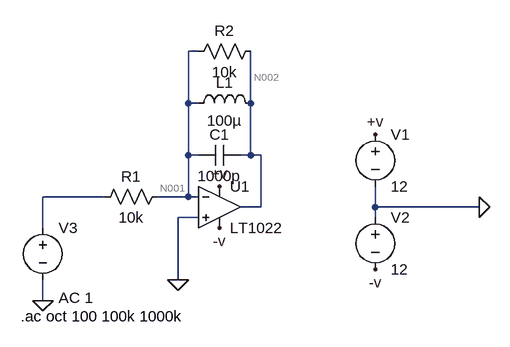
[diagram p0: schematic Draft26.asc]
Draft26.asc, the LTspice schematic file:
Version 4
SHEET 1 880 680
WIRE 176 -48 160 -48
WIRE 160 32 160 -48
WIRE 176 32 160 32
WIRE 256 32 256 -48
WIRE 160 112 160 32
WIRE 176 112 160 112
WIRE 256 112 256 32
WIRE 256 112 240 112
WIRE 272 112 256 112
WIRE 32 176 -64 176
WIRE 160 176 160 112
WIRE 160 176 112 176
WIRE 176 176 160 176
WIRE 272 192 272 112
WIRE 272 192 240 192
WIRE 448 192 448 160
WIRE 608 192 448 192
WIRE 176 208 144 208
WIRE 448 208 448 192
WIRE -64 224 -64 176
WIRE 144 304 144 208
WIRE -64 336 -64 304
FLAG 208 160 +v
FLAG 448 80 +v
FLAG 208 224 -v
FLAG 448 288 -v
FLAG -64 336 0
FLAG 144 304 0
FLAG 608 192 0
SYMBOL voltage 448 64 R0
SYMATTR InstName V1
SYMATTR Value 12
SYMBOL voltage 448 192 R0
SYMATTR InstName V2
SYMATTR Value 12
SYMBOL voltage -64 208 R0
WINDOW 123 24 124 Left 2
WINDOW 39 0 0 Left 0
SYMATTR InstName V3
SYMATTR Value ""
SYMATTR Value2 AC 1
SYMBOL Opamps\\LT1022 208 128 R0
SYMATTR InstName U1
SYMBOL res 128 160 R90
WINDOW 0 0 56 VBottom 2
WINDOW 3 32 56 VTop 2
SYMATTR InstName R1
SYMATTR Value 10k
SYMBOL res 272 -64 R90
WINDOW 0 0 56 VBottom 2
WINDOW 3 32 56 VTop 2
SYMATTR InstName R2
SYMATTR Value 10k
SYMBOL ind 160 48 R270
WINDOW 0 32 56 VTop 2
WINDOW 3 5 56 VBottom 2
SYMATTR InstName L1
SYMATTR Value 100µ
SYMBOL cap 240 96 R90
WINDOW 0 0 32 VBottom 2
WINDOW 3 32 32 VTop 2
SYMATTR InstName C1
SYMATTR Value 1000p
TEXT -98 360 Left 2 !.ac oct 100 100k 1000k

The netlist it stands for:
* Draft26.asc
V1 +v 0 12
V2 0 -v 12
V3 N003 0 AC 1
XU1 0 N001 +v -v N002 LT1022  ; pins In+ In- V+ V- OUT
R1 N001 N003 10k
R2 N002 N001 10k
L1 N001 N002 100µ
C1 N002 N001 1000p
.ac oct 100 100k 1000k
.backanno
.end

* Results of the author's LTspice run, read from the files saved beside the schematic
* Operating Point, zero values left out:
*   V(+v) = 12 V
*   V(-v) = -12 V
*   I(V2) = -5.2 mA
*   I(V1) = -5.2 mA
*   Ix(u1:3) = 5.2 mA
*   Ix(u1:4) = -5.2 mA
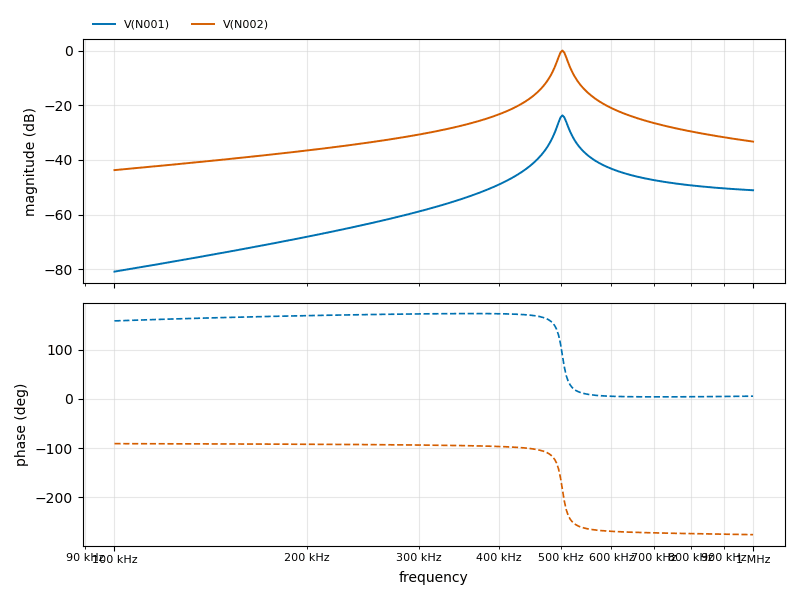
[diagram p1: AC Analysis of Draft26.asc, plotted from the saved traces]
* AC Analysis, 1 run:
*   V(N001): -80.85 dB at 100 kHz, -51.09 dB at 1 MHz, peak -23.69 dB at 502.8 kHz, 3 dB below the peak at 495.2 kHz and 511 kHz
*   V(N002): -43.73 dB at 100 kHz, -33.30 dB at 1 MHz, peak 0.03 dB at 502.8 kHz, 3 dB below the peak at 494.9 kHz and 510.8 kHz